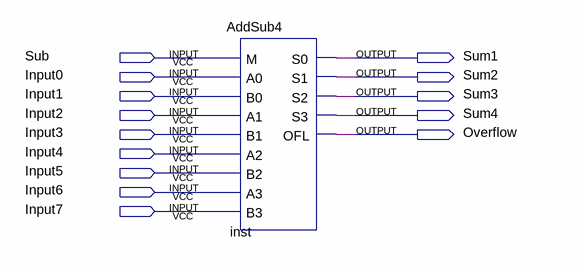
[diagram p0: schematic sheet]
// Quartus schematic AddSubDemo.bdf as structural Verilog: 1 symbols, 14 pins
module AddSubDemo (
  input  Sub,
  input  Input0,
  input  Input1,
  input  Input2,
  input  Input3,
  input  Input4,
  input  Input5,
  input  Input6,
  input  Input7,
  output Sum1,
  output Sum2,
  output Sum3,
  output Sum4,
  output Overflow
);

  AddSub4 inst (
    .M(Sub), .A0(Input0), .B0(Input1), .A1(Input2), .B1(Input3), .A2(Input4), .B2(Input5), .A3(Input6),
    .B3(Input7), .S0(Sum1), .S1(Sum2), .S2(Sum3), .S3(Sum4), .OFL(Overflow));
endmodule
